# Altium schematic sheet Option_CTP.SchDoc
size 297 x 209 mm
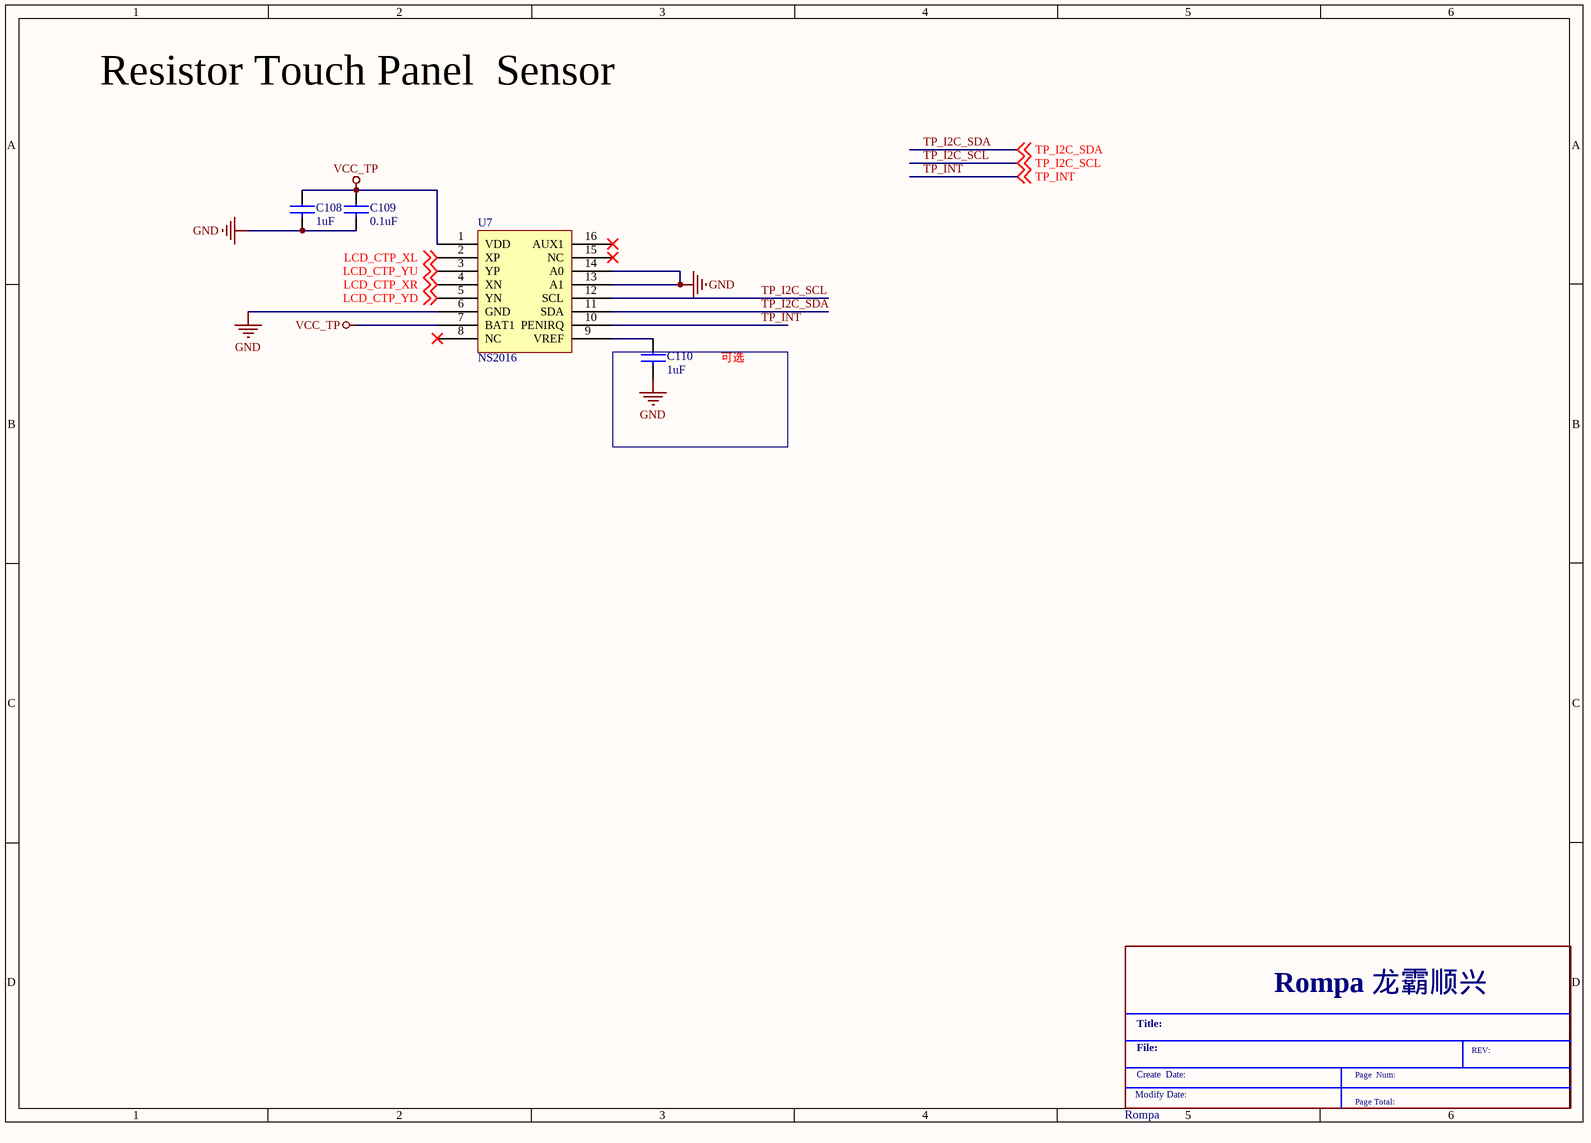
[diagram p0: Option_CTP.SchDoc]

## Parts
*  Rompa  (graphical)
C108  1uF  [C0402]
C109  0.1uF  [C0402]
C110  1uF  [C0402]
U7  NS2016  [SSOP16]

## Blocks framed on the sheet
可选: C110

## Nets
GND: C108.2 C109.2 C110.2 U7.6(GND) U7.13(A1) U7.14(A0)
VCC_TP: C108.1 C109.1 U7.1(VDD) U7.7(BAT1)
LCD_CTP_XL: U7.2(XP) ; off-sheet LCD_CTP_XL
LCD_CTP_XR: U7.4(XN) ; off-sheet LCD_CTP_XR
LCD_CTP_YD: U7.5(YN) ; off-sheet LCD_CTP_YD
LCD_CTP_YU: U7.3(YP) ; off-sheet LCD_CTP_YU
TP_I2C_SCL: U7.12(SCL) ; off-sheet TP_I2C_SCL
TP_I2C_SDA: U7.11(SDA) ; off-sheet TP_I2C_SDA
TP_INT: U7.10(PENIRQ) ; off-sheet TP_INT
NetC110_1: C110.1 U7.9(VREF)

Not connected (* = marked no-connect by the designer): U7 8(NC)* 15(NC)* 16(AUX1)*

## Notes on the sheet
- Resistor Touch Panel  Sensor
- (in symbol Rompa) Rompa 龙霸顺兴; Title:; File:; REV:; Create  Date:; Page  Num:; Modify Date:; Page Total:

## Library data of the parts
C108-C110 = CAP NP
U7 = NS2016: TSSOP-16